# EasyEDA Pro project USB_C_BREADBOARD_PD.eprj, board PCB2_1
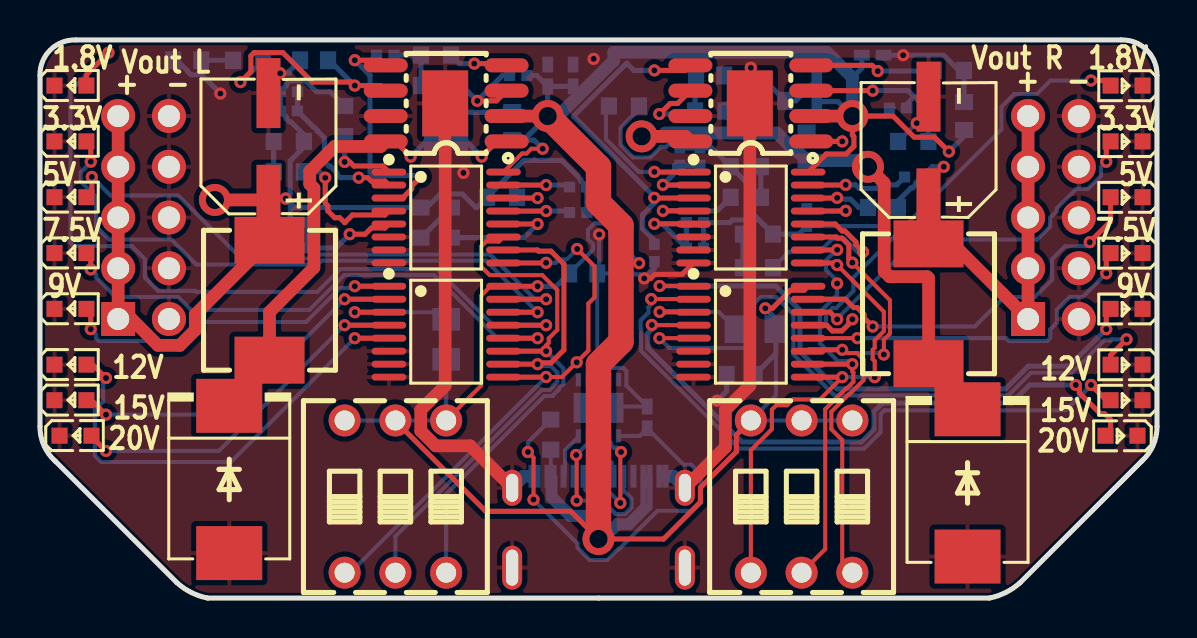
[diagram p8: board, top side]
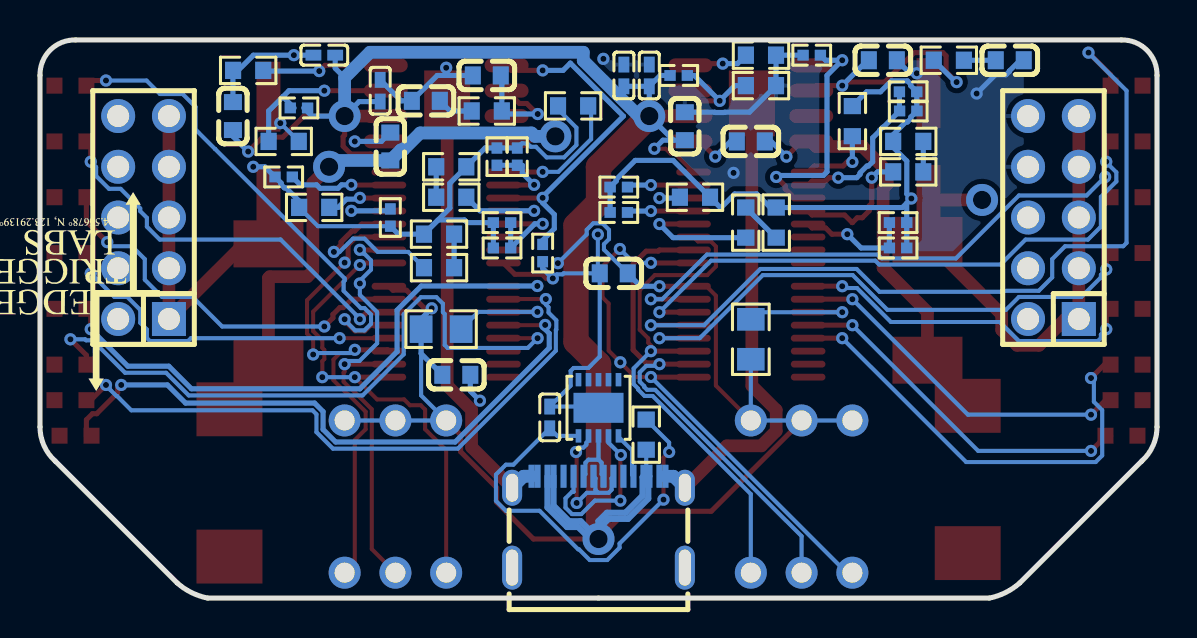
[diagram p9: board, bottom side, seen from below]

Outline 55.88 x 27.94 mm; copper layers: Top Layer, Bottom Layer. Coordinates in mm from the lower left corner of the outline.
Outline path: 0,26.16 0,8.57 arc(0.2,7.63) 0.76,6.86 6.86,0.76 arc(7.57,0.28) 8.38,0 47.5,0 arc(48.31,0.28) 49.02,0.76 55.12,6.86 arc(55.68,7.63) 55.88,8.57 55.88,26.16 arc(55.37,27.43) 54.1,27.94 1.78,27.94 arc(0.51,27.43) 0,26.16
Stack: Top Layer 0.035mm / Dielectric1 1.51mm FR4 er 4.5 / Bottom Layer 0.035mm

## Design rules (mm)
template: JLCPCB Capability(Two Layers Board)
spacing copperThickness1oz (default): track to track 0.102, other pairs 0.152 to 0.3
spacing copperThickness2oz: track to track 0.203, other pairs 0.152 to 0.3
track width copperThickness1oz (default): min 0.127, default 0.254, max 2.54
track width copperThickness2oz: min 0.203, default 0.254, max 2.54
differential pair differentialPair (default): width min 0.127, default 0.254, max 2.54; gap min 0.152, default 0.152
via viaSize (default): diameter min 0.5, default 0.61, max 10; hole min 0.3, default 0.305, max 6.3

## Placement (name value [footprint] x y rotation side)
C3  100nF  [C0603]  20.32 22.86 180 bottom
C7  2.2uF  [C0402]  26.67 26.16 90 bottom
C8  2.2uF  [C0402]  25.4 26.16 90 bottom
C10  680pF  [C0603]  7.37 26.92 0 bottom
C11  100pF  [C0603]  13.72 26.92 0 bottom
C18  1uF  [C0402]  30.38 9.04 90 bottom
C25  100nF  [C0603]  23.62 23.62 90 bottom
C26  100nF  [C0603]  27.18 16.26 0 bottom
C27  100pF  [C0603]  33.53 26.16 180 bottom
C28  680pF  [C0603]  36.58 24.89 180 bottom
C29  2.2uF  [C0402]  41.66 27.18 0 bottom
C30  2.2uF  [C0402]  38.86 25.4 90 bottom
C31  100nF  [C0603]  38.35 22.61 270 bottom
C32  100nF  [C0603]  35.05 11.18 180 bottom
C33  100nF  [C0603]  46.23 24.13 90 bottom
C_L1  100uF  [CAP-SMD_BD6.3-L6.6-W6.6-LS7.6-FD]  11.43 22.61 90 top
C_R  100uF  [CAP-SMD_BD6.3-L6.6-W6.6-LS7.6-FD]  44.45 22.43 90 top
H8  -  [HDR-TH_10P-P2.54-V-M-R2-C5-S2.54]  50.7 19.05 90 bottom
H9  -  [HDR-TH_10P-P2.54-V-M-R2-C5-S2.54]  5.18 19.05 90 bottom
L_1.8V  KT-0603R  [LED0603-RD]  1.52 25.65 0 top
L_3.3V  KT-0603R  [LED0603-RD]  1.52 22.86 0 top
L_5V  KT-0603R  [LED0603-RD]  1.52 20.07 0 top
L_7.5V  KT-0603R  [LED0603-RD]  1.52 17.27 0 top
L_9V  KT-0603R  [LED0603-RD]  1.52 14.48 0 top
L_12V  KT-0603R  [LED0603-RD]  1.52 11.68 0 top
L_15V  KT-0603R  [LED0603-RD]  1.52 9.91 0 top
L_20V  KT-0603R  [LED0603-RD]  1.78 8.13 0 top
LEFT_DIODE  B560C  [SMC_L6.9-W5.9-LS7.9-RD]  9.47 5.94 270 top
LEFT_DIODE1  B560C  [SMC_L6.9-W5.9-LS7.9-RD]  46.4 5.76 270 top
LEFT_INDUCTOR  10uH  [IND-SMD_L7.3-W6.8]  11.48 14.91 90 top
LEFT_LED_MUX  TMUX4051PWR  [TSSOP-16_L5.0-W4.4-P0.65-LS6.4-BL]  20.32 13.34 270 top
LEFT_VRM_MUX  TMUX4051PWR  [TSSOP-16_L5.0-W4.4-P0.65-LS6.4-BL]  20.32 19.05 270 top
R1  10.2kΩ  [R0402]  17.27 27.18 180 bottom
R29  31.6kΩ  [R0603]  23.11 20.07 180 bottom
R30  105kΩ  [R0603]  15.24 23.88 90 bottom
R32  82kΩ  [R0603]  19.05 18.8 90 bottom
R33  3.3kΩ  [R0603]  20.57 18.8 90 bottom
R34  243kΩ  [R0603]  12.45 22.86 0 bottom
R35  1.8kΩ  [R0603]  12.45 21.34 180 bottom
R45  86.6kΩ  [R0603]  19.81 25.65 0 bottom
R46  162kΩ  [R0603]  19.81 27.18 0 bottom
R47  10kΩ  [R0603]  10.41 26.92 0 bottom
R58  12.7kΩ  [R0402]  26.92 19.3 0 bottom
R59  150kΩ  [R0402]  12.95 17.53 180 bottom
R60  2.2MΩ  [R0402]  12.95 18.8 180 bottom
R61  220kΩ  [R0402]  12.45 25.34 180 bottom
R62  820kΩ  [R0402]  12.45 24.38 180 bottom
R63  53.6kΩ  [R0402]  26.92 20.57 0 bottom
R64  10kΩ  [R0603]  33.53 24.38 180 bottom
R65  86.6kΩ  [R0603]  43.69 22.86 0 bottom
R66  162kΩ  [R0603]  45.47 26.42 180 bottom
R68  12.7kΩ  [R0402]  38.35 19.05 270 bottom
R69  31.6kΩ  [R0603]  42.16 19.56 0 bottom
R70  82kΩ  [R0603]  35.92 18.22 0 bottom
R71  3.3kΩ  [R0603]  35.92 16.54 180 bottom
R72  105kΩ  [R0603]  29.21 24.64 0 bottom
R73  150kΩ  [R0402]  32.77 17.53 0 bottom
R74  2.2MΩ  [R0402]  32.77 18.8 0 bottom
R75  243kΩ  [R0603]  35.31 21.59 180 bottom
R76  1.8kΩ  [R0603]  35.31 20.07 0 bottom
R77  220kΩ  [R0402]  32 22.1 90 bottom
R78  820kΩ  [R0402]  33.02 22.1 90 bottom
R79  10.2kΩ  [R0402]  30.73 17.27 90 bottom
R80  53.6kΩ  [R0402]  43.69 21.08 0 bottom
R83  1.2kΩ  [R0805]  35.81 13.46 180 bottom
R84  1.2kΩ  [R0805]  20.32 12.95 90 bottom
R85  365kΩ  [R0402]  42.93 24.54 0 bottom
R86  365kΩ  [R0402]  23.93 26.16 180 bottom
R87  10Ω  [R0603]  25.55 8.18 90 bottom
R_1.8V  KT-0603R  [LED0603-RD]  54.36 25.65 180 top
R_3.3V  KT-0603R  [LED0603-RD]  54.36 22.86 180 top
R_5V  KT-0603R  [LED0603-RD]  54.36 20.07 180 top
R_7.5V  KT-0603R  [LED0603-RD]  54.36 17.27 180 top
R_9V  KT-0603R  [LED0603-RD]  54.36 14.48 180 top
R_12V  KT-0603R  [LED0603-RD]  54.36 11.68 180 top
R_15V  KT-0603R  [LED0603-RD]  54.36 9.91 180 top
R_20V  KT-0603R  [LED0603-RD]  54.1 8.13 180 top
RIGHT_INDUCTOR  10uH  [IND-SMD_L7.3-W6.8]  44.45 14.73 90 top
RIGHT_LED_MUX  TMUX4051PWR  [TSSOP-16_L5.0-W4.4-P0.65-LS6.4-BL]  35.56 13.34 270 top
RIGHT_VRM_MUX  TMUX4051PWR  [TSSOP-16_L5.0-W4.4-P0.65-LS6.4-BL]  35.56 19.05 270 top
SW_LEFT  DSWB03LHGET  [SW-TH_DSWB03LHGET]  17.78 5.08 0 top
SW_RIGHT  DSWB03LHGET  [SW-TH_DSWB03LHGET]  38.1 5.08 0 top
USB_C_CONNECTOR  UKIBATCCA  [USB-C-SMD_UKIBATCCA]  27.94 3.81 180 bottom
USB_C_PD  HUSB238_002DD  [DFN-10_L3.0-W3.0-P0.50-BL-EP2.5]  27.94 9.53 180 bottom
VRM_LEFT1  TPS54340DDAR  [SOIC-8_L4.9-W3.9-P1.27-LS6.0-BL-EP3.3]  20.32 24.77 90 top
VRM_RIGHT  TPS54340DDAR  [SOIC-8_L4.9-W3.9-P1.27-LS6.0-BL-EP3.3]  35.56 24.77 90 top

## Footprints (pads in the part's own frame, mm; a bottom-side part is the same pattern mirrored in y, then rotated)
C0402
  rect 0.79x0.54 smd: 1(-0.545,0) 2(0.545,0)
C0603
  rect 0.8x0.9 smd: 1(-0.7,0) 2(0.7,0)
CAP-SMD_BD6.3-L6.6-W6.6-LS7.6-FD
  rect 3.5x1.2 smd: 1(-2.67,0) 2(2.67,0)
DFN-10_L3.0-W3.0-P0.50-BL-EP2.5
  rect 0.28x0.665 smd: 1(-1,-1.407) 2(-0.5,-1.407) 3(0,-1.407) 4(0.5,-1.407) 5(1,-1.407) 6(1,1.407) 7(0.5,1.407) 8(0,1.407) 9(-0.5,1.407) 10(-1,1.407)
  rect 2.5x1.5 smd: 11(0,0)
HDR-TH_10P-P2.54-V-M-R2-C5-S2.54
  rect 1.7x1.7 hole 1.1: 1(-5.08,-1.27)
  round 1.7 hole 1.1: 2(-5.08,1.27) 3(-2.54,-1.27) 4(-2.54,1.27) 5(0,-1.27) 6(0,1.27) 7(2.54,-1.27) 8(2.54,1.27) 9(5.08,-1.27) 10(5.08,1.27)
IND-SMD_L7.3-W6.8
  rect 2.35x3.5 smd: 1(-3,0) 2(3,0)
LED0603-RD
  rect 0.8x0.8 smd: 1(-0.799,0) 2(0.799,0)
R0402
  rect 0.566x0.54 smd: 1(-0.433,0) 2(0.433,0)
R0603
  rect 0.806x0.864 smd: 1(-0.753,0) 2(0.753,0)
R0805
  rect 1.133x1.377 smd: 1(-1,0) 2(1,0)
SMC_L6.9-W5.9-LS7.9-RD
  rect 2.7x3.3 smd: 1(-3.687,0) 2(3.687,0)
SOIC-8_L4.9-W3.9-P1.27-LS6.0-BL-EP3.3
  oval 0.7x2.2 smd: 1(-1.905,-3.022) 2(-0.635,-3.022) 3(0.635,-3.022) 4(1.905,-3.022) 5(1.905,3.022) 6(0.635,3.022) 7(-0.635,3.022) 8(-1.905,3.022)
  rect 3.3x2.3 smd: 9(0,0.051)
SW-TH_DSWB03LHGET
  round 1.6 hole 1: 1(-2.54,3.81) 2(0,3.81) 3(2.54,3.81) 4(-2.54,-3.81) 5(0,-3.81) 6(2.54,-3.81)
TSSOP-16_L5.0-W4.4-P0.65-LS6.4-BL
  oval 0.343x1.732 smd: 1(-2.275,-2.866) 2(-1.625,-2.866) 3(-0.975,-2.866) 4(-0.325,-2.866) 5(0.325,-2.866) 6(0.975,-2.866) 7(1.625,-2.866) 8(2.275,-2.866) 9(2.275,2.866) 10(1.625,2.866) 11(0.975,2.866) 12(0.325,2.866) 13(-0.325,2.866) 14(-0.975,2.866) 15(-1.625,2.866) 16(-2.275,2.866)
USB-C-SMD_UKIBATCCA
  oval 1x1.8 hole 0.6x1.4: 1(-4.32,1.712) 2(4.32,1.712)
  oval 1x2.2 hole 0.6x1.8: 3(4.32,-2.288) 4(-4.32,-2.288)
  rect 0.3x1.15 smd: A1(-3.35,2.288) A4(-2.55,2.288) A5(-1.25,2.288) A6(-0.25,2.288) A7(0.25,2.288) A8(1.25,2.288) A9(2.55,2.288) A12(3.35,2.288) B1(3.05,2.288) B4(2.25,2.288) B5(1.75,2.288) B6(0.75,2.288) B7(-0.75,2.288) B8(-1.75,2.288) B9(-2.25,2.288) B12(-3.05,2.288)

## Nets
As in the schematic.

Pads without a net: USB_C_CONNECTOR A8 B8; USB_C_PD 6 7 8 9 10

## Via types
v1: diameter 0.61, hole 0.305, Top Layer to Bottom Layer, 102 vias
v2: diameter 1.6, hole 0.914, Top Layer to Bottom Layer, 6 vias

## Routing (per net, layer and track width the routed paths; a pad name or vN(x,y) marks a point on that pad's centre or on a via; arc(x,y) is an arc through that point)
GND: length 91.6
  Top Layer w0.254: v1(30.23,16) 30.55,16 30.76,16.21 32.13,16.21 RIGHT_VRM_MUX.8
  Top Layer w0.635: VRM_LEFT1.9 20.27,10.63 19.05,9.42 19.05,8.36 19.79,7.62 21.52,7.62 USB_C_CONNECTOR.2 ; USB_C_CONNECTOR.1 34.29,7.55 34.29,9.42 35.51,10.63 VRM_RIGHT.9
  Bottom Layer w0.203: C26.2 27.88,12.09 28.45,11.52 29.19,11.52 29.33,11.37 29.33,10.63 C18.2 28,9.59 USB_C_PD.11 ; C26.2 29.69,16.26 29.74,16.21 30.02,16.21 v1(30.23,16) ; C26.2 27.97,16.35 v1(27.97,18.2) ; v1(35.56,26.55) 35.59,26.52 35.59,26.16 ; R65.1 43.85,23.77 v1(43.86,23.77)
  Bottom Layer w0.254: C29.2 v1(43.18,27.18) 45.2,27.18 46.22,26.16 ; C10.1 6.85,26.92 7.39,26.38 7.39,26.36 7.55,26.2 8.08,26.2 v1(9.02,25.26) ; R66.1 46.23,26.41 C33.2 ; v1(30.23,16) 30.73,16.51 R79.1 ; v1(12.02,26.27) 12.49,26.27 ; C25.2 22.13,24.32 22.12,24.31 21.63,24.31 21.62,24.32 20.39,24.32 R45.1 R46.1 R1.1 ; C27.1 36.01,26.16 C28.1 37.81,24.89 C30.2 ; C32.2 34.35,10.36 v1(33.87,9.88) ; 12.49,26.4 C11.1
  Bottom Layer w0.635: USB_C_CONNECTOR.1 31.68,6.1 USB_C_CONNECTOR.A1 ; USB_C_CONNECTOR.A12 24.19,6.1 USB_C_CONNECTOR.2
  vias: v1(21.18,21.29) v1(27.7,26.99)
VBUS: length 158.4
  Top Layer w0.203: 23.19,21.33 24.12,22.26 24.34,22.26 24.58,22.49 v1(25.15,22.49) ; LEFT_LED_MUX.16 22.54,15.61 22.07,15.14 22.07,10.64 SW_LEFT.3
  Top Layer w0.254: v1(36.28,14.51) 36.64,14.51 37.54,15.41 38.23,15.41 RIGHT_LED_MUX.16 ; SW_RIGHT.1 34.84,8.17 34.84,7.33 33.04,5.53 33.04,4.8 31.19,2.96 v2(27.94,2.96) 26.55,4.34 22.3,4.34 17.78,8.86 SW_LEFT.2 ; v1(45.47,22.35) 44.75,23.07 43.73,23.07 42.68,24.13 v2(40.64,24.13) 40.64,23.18 40.72,23.1 40.72,22.62 40.33,22.23 39.33,22.23 38.43,21.33 ; LEFT_LED_MUX.16 v1(24.89,15.61)
  Top Layer w0.635: VRM_LEFT1.2 v2(25.4,24.13) ; v2(40.64,24.13) VRM_RIGHT.2
  Top Layer w1.27: v2(27.94,2.96) 27.94,11.71 29.06,12.83 29.06,18.65 27.94,19.78 27.94,21.59 v2(25.4,24.13)
  Bottom Layer w0.203: SW_LEFT.1 SW_LEFT.2 SW_LEFT.3 R84.1 ; 36.81,12.24 36.81,10.14 SW_RIGHT.1 SW_RIGHT.2 SW_RIGHT.3 ; R87.1 25.55,6.26 USB_C_CONNECTOR.A9 ; C26.1 27.67,17.45 27.67,17.72 27.41,17.97 27.41,18.43 27.74,18.76 28.2,18.76 28.53,18.43 28.53,18.2 v1(29.97,16.76)
  Bottom Layer w0.254: v1(45.47,22.35) 46.23,23.11 C33.1 ; 24.19,22.92 24.72,22.92 v1(25.15,22.49) ; 24.19,22.92 v2(25.4,24.13) C8.1 ; 24.19,22.92 C25.1 ; C30.1 39.91,24.86 v2(40.64,24.13) 42.28,24.13 42.68,24.54 ; v1(36.28,14.51) 36.81,13.98 R83.1 36.81,12.24 C32.1 ; C29.1 41.11,26.52 40.64,26.05 ; C8.1 C7.1 ; C8.1 24.85,26.16 R86.1 ; v1(24.89,15.61) 25.83,15.61 C26.1
  Bottom Layer w0.305: v2(27.94,2.96) 28.83,3.85 29.41,3.85 30.19,4.63 USB_C_CONNECTOR.B9 ; v2(27.94,2.96) 28.36,2.96 28.96,3.56 29.51,3.56 30.49,4.53 USB_C_CONNECTOR.A4 ; v2(27.94,2.96) 27.94,3.45 ; 27.94,3.45 27.94,3.85 27.52,4.27 26.6,4.27 25.74,5.13 25.74,6.05 USB_C_CONNECTOR.B4 ; 27.94,3.45 27.43,3.96 26.47,3.96 25.45,4.98 25.45,6.04 USB_C_CONNECTOR.A9
  Bottom Layer w0.635: v2(25.4,24.13) 25.93,24.13 28.7,26.91 28.7,27.32 39.37,27.32 40.64,26.05 v2(40.64,24.13)
CC1: length 8.4
  Top Layer w0.203: v1(26.85,4.88) 26.85,7.14 v1(26.82,7.16)
  Bottom Layer w0.203: USB_C_PD.4 27.44,7.78 v1(26.82,7.16) ; v1(26.85,4.88) 28.13,4.88 28.8,4.2 29.26,4.2 29.59,4.53 29.59,4.99 29.26,5.32 29.19,5.32 29.19,5.32 USB_C_CONNECTOR.A5
CC2: length 2.3
  Bottom Layer w0.203: USB_C_PD.5 26.94,8.07 26.26,7.39 26.26,6.17 USB_C_CONNECTOR.B5
D+: length 7.4
  Top Layer w0.203: v1(29.03,4.76) 29.03,7.28 v1(29.07,7.31)
  Bottom Layer w0.203: 27.94,5.27 28.09,5.42 28.09,6 USB_C_CONNECTOR.A6 ; 27.94,5.27 28.52,5.27 v1(29.03,4.76) ; 27.94,5.27 27.44,5.27 27.29,5.42 27.29,6 USB_C_CONNECTOR.B6 ; v1(29.07,7.31) 28.85,7.53 28.69,7.53 28.55,7.68 28.55,7.78 28.44,7.89 USB_C_PD.2
D-: length 3.6
  Bottom Layer w0.203: USB_C_CONNECTOR.A7 27.79,6.19 27.79,6.78 27.94,6.93 ; USB_C_PD.3 27.94,6.93 27.94,6.93 ; USB_C_CONNECTOR.B7 28.59,6.19 28.59,6.78 28.44,6.93 27.94,6.93
FB_L: length 13.5
  Top Layer w0.254: LEFT_VRM_MUX.3 18.14,20.03 18.6,20.49 18.6,20.63 v1(19.05,21.08) ; v1(15.75,26.92) 17.04,26.92 VRM_LEFT1.5
  Bottom Layer w0.254: v1(19.05,21.08) 18.98,21.16 16.69,21.16 16.51,21.34 16.51,26.16 v1(15.75,26.92) 16.59,26.92 R1.2
FB_R: length 17.7
  Top Layer w0.254: VRM_RIGHT.5 32.28,26.42 v1(30.73,26.42) ; RIGHT_VRM_MUX.3 30.74,20.03 v1(30.73,20.04)
  Bottom Layer w0.254: 30.73,17.7 30.73,17.91 30.15,18.49 30.15,19.2 30.73,19.78 v1(30.73,20.04) 30.73,20.08 26.69,24.12 29.35,26.78 29.35,26.78 29.71,26.42 v1(30.73,26.42)
L_A0: length 26.2
  Top Layer w0.203: LEFT_VRM_MUX.11 22.96,17.85 22.32,17.85 22.07,17.6 22.07,16.6 22.5,16.17 25.12,16.17 25.88,15.41 25.88,13.43 25.45,13 25.45,12.78 25.32,12.65 v1(25.32,12.36)
  Top Layer w0.254: LEFT_LED_MUX.11 25.32,12.36
  Bottom Layer w0.203: v1(25.32,12.36) 26.18,11.5 26.18,10.71 25.96,10.49 25.96,10.44 25.64,10.12 25.23,10.12 20.32,5.2 SW_LEFT.6
L_A1: length 25.7
  Top Layer w0.254: LEFT_VRM_MUX.10 24.89,17.43 24.95,17.37 25.56,17.37 26.21,16.72 26.21,12.42 25.56,11.78 24.96,11.78 v1(24.89,11.71) ; LEFT_LED_MUX.10 24.89,11.71
  Bottom Layer w0.203: v1(24.89,11.71) 24.97,11.63 25.55,11.63 25.88,11.3 25.88,10.84 25.65,10.61 25.65,10.57 25.51,10.42 25.11,10.42 17.78,3.1 SW_LEFT.5
L_A2: length 28.5
  Top Layer w0.203: v1(25.32,11.07) 26.11,11.07 v1(26.85,11.8) 27.43,12.39 27.43,14.74 27.74,15.05 27.74,16.61 v1(26.87,17.48)
  Top Layer w0.254: v1(25.32,16.78) 25.31,16.78 LEFT_VRM_MUX.9 ; 25.3,11.07 25.3,11.06 LEFT_LED_MUX.9
  Bottom Layer w0.203: v1(25.32,16.78) 25.8,16.78 25.97,16.96 26.36,16.96 v1(26.87,17.48) ; v1(25.32,11.07) 15.52,1.27 SW_LEFT.4
L_LED_0: length 41.5
  Top Layer w0.254: v1(3.43,27.31) 2.32,26.2 L_1.8V.2 ; LEFT_LED_MUX.13 v1(25.32,13.66)
  Bottom Layer w0.203: v1(3.43,27.31) 1.52,25.4 1.52,17.78 1.69,17.61 4.6,17.61 5.24,16.97 5.24,16.05 5.92,15.38 7.76,15.38 7.81,15.33 13.88,15.33 15.03,16.47 19.84,16.47 22.66,13.66 v1(25.32,13.66)
L_LED_1: length 30.6
  Top Layer w0.254: L_3.3V.2 2.54,22.64 v1(2.54,21.84) ; LEFT_LED_MUX.14 v1(24.89,14.31)
  Bottom Layer w0.203: v1(24.89,14.31) 22.31,16.89 14.09,16.89 13.9,16.7 7.83,16.7 6.58,17.95 3.45,17.95 2.81,18.59 2.81,20.08 2.04,20.85 2.04,21.32 2.54,21.82 v1(2.54,21.84)
L_LED_2: length 28.7
  Top Layer w0.254: L_5V.2 2.59,20.34 v1(2.59,21.08) ; LEFT_LED_MUX.15 v1(25.32,14.96)
  Bottom Layer w0.203: v1(25.32,14.96) 24.75,14.96 22.52,17.2 13.97,17.2 13.77,17 10.06,17 6.91,20.15 3.52,20.15 v1(2.59,21.08)
L_LED_3: length 27.9
  Top Layer w0.254: v1(2.54,16.45) 2.54,17.06 L_7.5V.2 ; LEFT_LED_MUX.12 24.89,13.01
  Bottom Layer w0.203: v1(2.54,16.45) 2.81,16.18 2.81,16.05 3.79,15.07 6.91,15.07 7.56,14.43 13.49,14.43 15.23,16.17 19.72,16.17 22.88,13.01 v1(24.89,13.01)
L_LED_4: length 17.5
  Top Layer w0.254: v1(15.75,15.61) 17.45,15.61 ; v1(2.54,13.46) 2.54,14.26 L_9V.2
  Bottom Layer w0.203: v1(2.54,13.46) 2.81,13.19 2.81,13.02 2.96,12.87 6.91,12.87 7.86,13.82 13.31,13.82 15.01,15.52 15.66,15.52 v1(15.75,15.61)
L_LED_5: length 22.8
  Top Layer w0.254: L_12V.2 2.63,11.68 v1(3.3,11.01) ; v1(15.75,13.01) LEFT_LED_MUX.5
  Bottom Layer w0.203: v1(3.3,11.01) 3.16,10.87 3.16,9.83 2.74,9.41 2.74,7.13 3.07,6.81 9.55,6.81 v1(15.75,13.01)
L_LED_6: length 17.8
  Top Layer w0.254: v1(15.24,14.96) LEFT_LED_MUX.2 ; L_15V.2 2.58,9.91 v1(3.3,9.18)
  Bottom Layer w0.203: v1(15.24,14.96) 9.46,9.18 v1(3.3,9.18)
L_LED_7: length 18.1
  Top Layer w0.254: v1(15.24,13.66) LEFT_LED_MUX.4 ; v1(3.3,7.37) 2.54,8.13 2.32,8.13
  Bottom Layer w0.203: v1(3.3,7.37) 8.95,7.37 v1(15.24,13.66)
L_S0: length 3.3
  Top Layer w0.254: LEFT_VRM_MUX.13 25.32,19.38
  Bottom Layer w0.254: R58.1 26.42,19.37 v1(25.32,19.37)
L_S1: length 2.7
  Top Layer w0.254: LEFT_VRM_MUX.14 v1(24.89,20.03)
  Bottom Layer w0.254: v1(24.89,20.02) 23.91,20.02 R29.1
L_S2: length 3.3
  Top Layer w0.254: LEFT_VRM_MUX.15 v1(25.32,20.68)
  Bottom Layer w0.254: R63.1 26.39,20.68 v1(25.32,20.68)
L_S3: length 6.3
  Top Layer w0.254: LEFT_VRM_MUX.12 v1(24.89,18.73)
  Bottom Layer w0.254: v1(24.89,18.72) 24.21,18.04 R33.1
L_S4: length 3.7
  Top Layer w0.254: v1(15.24,21.83) 15.5,21.83 15.7,21.63 17.15,21.63 17.45,21.33
  Bottom Layer w0.254: v1(15.24,21.83) R30.1
L_S5: length 5.8
  Top Layer w0.254: LEFT_VRM_MUX.5 17.25,18.53 16.57,18.53 16.26,18.22 v1(15.49,18.22)
  Bottom Layer w0.254: v1(15.49,18.22) 14.8,17.53 R59.1 R60.1
L_S6: length 7.8
  Top Layer w0.254: v1(15.94,21.05) 16.4,21.05 16.57,20.87 17.25,20.87 LEFT_VRM_MUX.2
  Bottom Layer w0.254: v1(15.94,21.05) 15.02,21.05 14.85,21.21 14.85,21.29 14.51,21.63 14.44,21.63 14.22,21.84 14.22,23.04 13.88,23.38 13.88,23.41 13.72,23.57 13.69,23.57 R62.1 12.88,24.39 12.88,25.34
L_S7: length 6.4
  Top Layer w0.254: LEFT_VRM_MUX.4 17.25,19.18 15.63,19.18 15.25,18.8 15.24,18.8 15,19.04 14.74,19.04 14.4,19.38 14.4,19.63 14.27,19.77 v1(14.27,21.05)
  Bottom Layer w0.254: R35.1 13.98,21.34 v1(14.27,21.05)
R_A0: length 25.6
  Top Layer w0.203: v1(42.21,12.19) 42.21,12.93 42.52,13.24 42.52,14.91 v1(40.64,16.79) ; SW_RIGHT.6 40.13,1.78 40.13,7.91 39.59,8.45 39.59,9.33 40.45,10.19 40.49,10.19 41.2,10.9 41.2,11.94 40.87,12.27 40.29,12.27 v1(40.13,12.43)
  Top Layer w0.254: v1(40.13,12.43) 38.49,12.43 RIGHT_LED_MUX.11 ; v1(40.64,16.79) 40.46,16.97 40.46,17.68 40.12,18.02 39.89,18.02 39.83,18.08 RIGHT_VRM_MUX.11
  Bottom Layer w0.203: v1(40.13,12.43) 40.29,12.27 42.14,12.27 v1(42.21,12.19)
R_A1: length 22.8
  Top Layer w0.203: SW_RIGHT.5 39.28,2.45 39.28,9.45 40.33,10.5 40.36,10.5 40.69,10.83 40.69,11.29 40.64,11.34 v1(40.64,11.71)
  Top Layer w0.254: RIGHT_VRM_MUX.10 39.87,17.43 v1(39.88,17.43) ; RIGHT_LED_MUX.10 40.64,11.71
  Bottom Layer w0.203: v1(39.88,17.43) 39.67,17.23 39.65,17.23 39.32,16.9 39.32,16.44 39.88,15.88 v1(39.88,15.75) 39.88,15.18 39.01,14.32 39.01,12.75 39.9,11.87 40.48,11.87 v1(40.64,11.71)
R_A2: length 24.5
  Top Layer w0.203: SW_RIGHT.4 35.56,7.4 36.61,8.45 36.61,9.44 36.83,9.65 37.37,9.65 37.66,9.94 39.02,9.94 v1(40.13,11.06) ; v1(39.88,16.67) 42.21,14.34 42.21,13.36 41.76,12.91 41.76,12.52 41.66,12.42 41.66,11.96 41.76,11.86 v1(41.76,11.06)
  Top Layer w0.254: v1(39.88,16.67) 39.78,16.78 RIGHT_VRM_MUX.9 ; 40.13,11.06 RIGHT_LED_MUX.9
  Bottom Layer w0.203: v1(41.76,11.06) v1(40.13,11.06)
R_LED_0: length 25.1
  Top Layer w0.254: v1(40.64,13.96) 40.46,13.78 40.46,13.72 40.12,13.37 39.64,13.37 39.35,13.66 RIGHT_LED_MUX.13 ; R_1.8V.2 53.3,25.91 v1(52.58,25.91)
  Bottom Layer w0.203: v1(40.64,13.96) 40.64,13.93 40.11,13.4 39.65,13.4 39.32,13.73 39.32,14.19 39.65,14.52 39.83,14.52 40.69,15.38 40.69,15.84 40.64,15.89 40.64,16 47.12,22.48 47.12,22.48 48.1,23.46 48.1,24.59 48.74,25.23 49.87,25.23 50.55,25.91 v1(52.58,25.91)
R_LED_1: length 20
  Top Layer w0.254: RIGHT_LED_MUX.14 39.53,14.31 v1(39.88,13.96) ; R_3.3V.2 53.34,22.64 v1(53.34,21.84)
  Bottom Layer w0.203: v1(39.88,13.96) 40.08,14.16 40.08,14.19 43.84,17.95 49.89,17.95 50.53,18.59 50.53,19.04 50.87,19.37 50.87,19.51 51.84,20.49 52.43,20.49 53.07,21.13 53.07,21.58 v1(53.34,21.84)
R_LED_2: length 19.8
  Top Layer w0.254: v1(52.52,17.82) 53.56,18.86 R_5V.2 ; v1(41.66,13.59) 41.22,14.03 41.22,14.2 40.88,14.54 40.71,14.54 40.29,14.96 RIGHT_LED_MUX.15
  Bottom Layer w0.203: v1(52.52,17.82) 52.31,17.61 51.28,17.61 50.64,16.97 50.64,15.94 49.77,15.07 48.25,15.07 46.76,13.59 v1(41.66,13.59)
R_LED_3: length 18.1
  Top Layer w0.203: RIGHT_LED_MUX.12 v1(40.89,13.01)
  Top Layer w0.254: v1(53.34,16.26) 53.34,17.06 R_7.5V.2
  Bottom Layer w0.203: v1(53.34,16.26) 52.16,15.07 51.51,15.07 50.87,14.43 50.87,13.78 50.53,13.45 50.53,13.02 50.38,12.87 48.47,12.87 48.33,13.01 v1(40.89,13.01)
R_LED_4: length 29.7
  Top Layer w0.203: v1(31,15.62) 32.68,15.62 RIGHT_LED_MUX.1
  Top Layer w0.254: v1(53.34,13.46) 53.34,14.26 R_9V.2
  Bottom Layer w0.254: v1(53.34,13.46) 51.49,11.61 49.44,11.61 48.3,10.47 39.88,10.47 38.02,12.34 38.02,14.41 36.81,15.62 v1(31,15.62)
R_LED_5: length 33.5
  Top Layer w0.203: RIGHT_LED_MUX.5 30.99,13.01
  Top Layer w0.254: v1(54.36,12.95) 53.56,12.15 R_12V.2
  Bottom Layer w0.203: v1(30.99,13.01) 31.48,12.52 35.49,12.52 35.63,12.67 35.63,14.22 35.72,14.31 35.72,14.74 36.05,15.06 36.83,15.06 37.68,14.2 37.68,12.2 39.74,10.14 48.44,10.14 49.57,11.28 51.62,11.28 53.25,12.9 53.57,12.9 53.62,12.95 v1(54.36,12.95)
R_LED_6: length 32.6
  Top Layer w0.203: v1(30.58,14.97) 32.69,14.97 RIGHT_LED_MUX.2
  Top Layer w0.254: R_15V.2 53.34,9.91 v1(52.58,10.67)
  Bottom Layer w0.203: v1(52.58,10.67) 52.37,10.46 52.37,10.44 52.05,10.11 52.02,10.11 51.31,9.4 42.25,9.4 42.05,9.2 42.05,8.31 41.22,7.48 34.98,7.48 30.07,12.38 30.07,13.42 30.05,13.44 30.05,13.9 30.44,14.29 30.44,14.56 30.58,14.7 v1(30.58,14.97)
R_LED_7: length 31.8
  Top Layer w0.203: RIGHT_LED_MUX.4 30.62,13.66 v1(30.61,13.67)
  Top Layer w0.254: v1(51.82,10.67) 51.99,10.49 51.99,10.27 53.04,9.23 53.26,9.23 53.56,8.93 53.56,8.13
  Bottom Layer w0.254: v1(51.82,10.67) 49.5,10.67 48.6,9.76 42.14,9.76 41.72,9.34 41.72,8.44 41.09,7.81 35.11,7.81 30.4,12.52 30.4,13.25 30.61,13.46 v1(30.61,13.67)
R_S0: length 3.9
  Top Layer w0.254: v1(40.31,19.39) 40.29,19.38 RIGHT_VRM_MUX.13
  Bottom Layer w0.254: v1(40.31,19.39) 38.45,19.39 R68.1
R_S1: length 3.2
  Top Layer w0.254: RIGHT_VRM_MUX.14 39.87,20.03 v1(39.88,20.04)
  Bottom Layer w0.254: v1(39.88,20.04) 39.94,19.97 40.55,19.97 40.96,19.56 R69.1
R_S2: length 5.1
  Top Layer w0.254: RIGHT_VRM_MUX.15 40.29,20.68 v1(40.31,20.69)
  Bottom Layer w0.254: v1(40.31,20.69) 40.8,20.69 40.97,20.51 41.87,20.51 42.04,20.69 42.86,20.69 R80.1
R_S3: length 8.8
  Top Layer w0.254: RIGHT_VRM_MUX.12 39.78,18.73 40.13,18.37 40.27,18.37 40.82,17.82 40.82,17.69 v1(41.18,17.33)
  Bottom Layer w0.203: v1(41.18,17.33) 40.89,17.33 40.23,17.99 39.65,17.99 38.98,17.33 37.46,17.33 R71.1
R_S4: length 6.8
  Top Layer w0.254: 32.69,21.33 30.75,21.33 v1(30.73,21.34)
  Bottom Layer w0.203: R72.1 28.31,24.49 28.31,22.98 29.95,21.34 v1(30.73,21.34)
R_S5: length 5.3
  Top Layer w0.254: v1(30.73,18.73) 32.68,18.73 RIGHT_VRM_MUX.5
  Bottom Layer w0.254: v1(30.73,18.73) 31.12,18.73 R73.1 R74.1
R_S6: length 4
  Top Layer w0.254: RIGHT_VRM_MUX.2 31.17,20.68 v1(31.16,20.69)
  Bottom Layer w0.254: R78.1 31.75,21.67 31.75,21.27 v1(31.16,20.69)
R_S7: length 5.2
  Top Layer w0.254: RIGHT_VRM_MUX.4 32.68,19.39 v1(31.16,19.39)
  Bottom Layer w0.254: R76.1 33.87,19.39 v1(31.16,19.39)
VOUT_L: length 54.8
  Top Layer w0.635: v2(8.75,19.93) 11.42,19.93 C_L1.1 ; H9.9 H9.7 H9.5 H9.3 H9.1 4.59,13.97 5.91,12.65 7,12.65 7.77,13.42 7.77,14.2 LEFT_INDUCTOR.2
  Bottom Layer w0.254: 12.52,19.77 v1(12.29,20) 12.52,20.23 12.52,21.88 13.2,22.57 R34.2 13.2,23.2 12.56,23.84 12.48,23.84 12.32,24 12.32,24.08 R62.2 12.02,24.39 R61.2 12.32,25.65 12.32,25.73 12.49,25.89 13.28,25.89 13.83,25.34 14.53,25.34 R30.2 ; 12.52,19.77 12.52,17.53 ; 12.52,19.77 12.74,19.55 R32.2 19.34,19.55 20.03,20.23 21.12,20.23 21.8,19.55 21.84,19.55 R29.2 24.2,21.91 26.1,21.91 27.05,20.96 27.05,20.88 R63.2 R58.2
VOUT_R: length 45.1
  Top Layer w0.635: RIGHT_INDUCTOR.2 45.67,17.73 H8.1 H8.3 H8.5 H8.7 H8.9
  Bottom Layer w0.203: R77.2 31.77,22.76 31.5,22.76 31.33,22.59 31.07,22.59 30.54,22.06 29.66,22.06 29.05,22.68 29.05,23.55 29.96,24.47 R72.2 ; R69.2 41.98,18.62 R68.2
  Bottom Layer w0.254: R68.2 37.95,18.22 R70.2 ; R70.2 35.96,18.93 34.64,18.93 34.51,18.8 33.2,18.8 33.2,17.53 ; R70.2 36.67,18.23 35.38,19.52 35.38,20.77 R75.2 33.61,22.53 R78.2 R77.2 ; v1(45.21,21.59) 44.63,21.59 R80.2 43.82,20.78 43.82,20.7 43.65,20.53 43.57,20.53 42.92,19.88 R69.2
$1N2320: length 3
  Top Layer w0.254: v1(22.1,22.1) 22.86,22.86 VRM_LEFT1.1
  Bottom Layer w0.254: C3.1 21.34,22.86 v1(22.1,22.1)
$1N2321: length 17.8
  Top Layer w0.254: v1(18.54,22.1) 17.78,22.86 VRM_LEFT1.8
  Top Layer w0.635: VRM_LEFT1.8 17.04,22.61 14.74,22.61 13.5,21.37 13.5,20.72 13.7,20.52 13.7,16.54 11.48,14.32 LEFT_INDUCTOR.1
  Bottom Layer w0.254: C3.2 19.3,22.86 v1(18.54,22.1)
$1N2348: length 5.4
  Top Layer w0.254: VRM_LEFT1.3 22.83,24.89 v1(21.88,24.89)
  Bottom Layer w0.254: R86.2 23.15,26.16 v1(21.88,24.89) 21.11,25.65 R45.2
$1N2349: length 3
  Top Layer w0.254: v1(21.73,26.76) 23.26,26.76 VRM_LEFT1.4
  Bottom Layer w0.254: R46.2 20.99,26.76 v1(21.73,26.76)
$1N2350: length 12.6
  Top Layer w0.254: v1(10.03,25.83) 10.55,26.36 10.55,27.14 10.71,27.31 12.15,27.31 13.62,25.83 15.57,25.83 v1(15.75,25.65) 17.04,25.65 VRM_LEFT1.6
  Bottom Layer w0.254: C11.2 14.48,26.92 v1(15.75,25.65) ; R47.2 10.07,25.83 v1(10.03,25.83)
$1N2351: length 1.6
  Bottom Layer w0.254: R47.1 C10.2
$1N2372: length 22.1
  Top Layer w0.203: v1(24.69,4.93) 24.69,7.03 v1(24.41,7.31)
  Bottom Layer w0.203: v1(24.41,7.31) 24.41,7.79 R87.2 ; USB_C_PD.1 30,8.12 C18.1 32.2,6.68 32.57,6.68 33.07,6.18 33.07,4.87 32.57,4.37 30.89,4.37 28.96,2.44 28.91,2.44 28.38,1.9 27.5,1.9 26.89,2.52 26.89,2.73 v1(24.69,4.93)
$1N8624: length 2.1
  Bottom Layer w0.254: R33.2 19.07,18.04 R32.1
$1N9271: length 1.5
  Bottom Layer w0.254: R35.2 R34.1
$1N10051: length 6.4
  Top Layer w0.254: v1(15.75,14.31) LEFT_LED_MUX.3
  Bottom Layer w0.203: v1(15.75,14.31) 19.96,14.31 R84.2
$1N12210: length 1.8
  Bottom Layer w0.254: C28.2 35.37,24.38 R64.1
$1N12211: length 5.7
  Top Layer w0.254: v1(30.98,24.23) 31,24.23 31.53,24.76 31.9,24.76 VRM_RIGHT.6
  Bottom Layer w0.254: C27.2 32.77,26.11 R64.2 32.62,24.23 v1(30.98,24.23)
$1N12212: length 6.3
  Top Layer w0.254: v1(41.91,26.38) 41.62,26.67 VRM_RIGHT.4
  Bottom Layer w0.254: v1(41.91,26.38) 44.49,26.38 44.71,26.16
$1N12213: length 8.9
  Top Layer w0.254: VRM_RIGHT.3 v1(41.66,25.4)
  Bottom Layer w0.254: 44.44,22.61 44.44,24.38 43.72,25.1 ; 43.72,25.1 43.72,25.09 43.17,24.54 ; 43.72,25.1 43.43,25.4 v1(41.66,25.4)
$1N12220: length 26.8
  Top Layer w0.635: RIGHT_INDUCTOR.1 44.45,16.02 44.38,16.09 42.51,16.09 42.23,16.36 42.23,20.78 v2(41.42,21.59) ; VRM_RIGHT.8 32.28,23.11 v2(30.1,23.11)
  Bottom Layer w0.635: v2(41.42,21.59) 41.1,21.91 C31.2 37.82,22.44 37.71,22.44 36.86,23.28 31.29,23.28 31.12,23.11 v2(30.1,23.11)
$1N12221: length 3.5
  Top Layer w0.254: VRM_RIGHT.1 v1(40.13,22.86)
  Bottom Layer w0.254: v1(40.13,22.86) 38.8,22.86 C31.1
$1N12258: length 1.7
  Bottom Layer w0.254: R71.2 R70.1
$1N12280: length 1.5
  Bottom Layer w0.254: R76.2 R75.1
$1N12321: length 5.9
  Top Layer w0.254: v1(31,14.33) 32.68,14.33 RIGHT_LED_MUX.3
  Bottom Layer w0.203: v1(31,14.33) 33.95,14.33 R83.2

## Copper pours and planes (outline as drawn; the poured copper is in the pictures)
GND on Top Layer: 0,7.62 0,27.94 55.88,27.94 55.88,7.62 48.26,0 7.62,0
GND on Bottom Layer: 6.67,26.92 27.88,26.92 27.88,16.26 6.67,16.26

Small or netless copper shapes (teardrops, artwork), in the pictures only: 1 on Bottom Layer

## Text on the board
Top Silkscreen Layer: 3.3V | 5V | 7.5V | 9V | 1.8V | 20V | 12V | 15V | + | Vout L | - | Vout R
